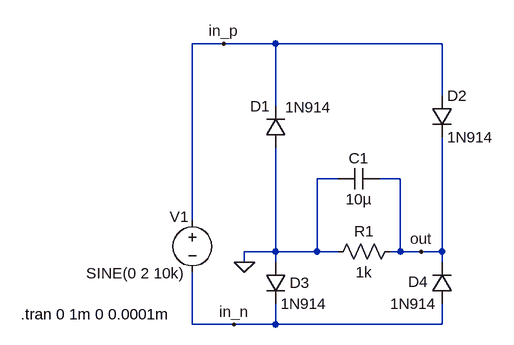
[diagram p0: schematic full_wave_rectifier_with_cap.asc]
full_wave_rectifier_with_cap.asc, the LTspice schematic file:
Version 4
SHEET 1 880 680
WIRE 96 -160 48 -160
WIRE 176 -160 96 -160
WIRE 432 -160 176 -160
WIRE 432 -80 432 -160
WIRE 176 -64 176 -160
WIRE 272 48 240 48
WIRE 368 48 336 48
WIRE 48 112 48 -160
WIRE 176 160 176 0
WIRE 176 160 128 160
WIRE 240 160 240 48
WIRE 240 160 176 160
WIRE 272 160 240 160
WIRE 368 160 368 48
WIRE 368 160 352 160
WIRE 400 160 368 160
WIRE 432 160 432 -16
WIRE 432 160 400 160
WIRE 128 176 128 160
WIRE 176 176 176 160
WIRE 432 176 432 160
WIRE 48 272 48 192
WIRE 112 272 48 272
WIRE 176 272 176 240
WIRE 176 272 112 272
WIRE 432 272 432 240
WIRE 432 272 176 272
FLAG 128 176 0
FLAG 400 160 out
FLAG 96 -160 in_p
FLAG 112 272 in_n
SYMBOL diode 192 0 R180
WINDOW 0 24 64 Left 2
WINDOW 3 -70 62 Left 2
SYMATTR InstName D1
SYMATTR Value 1N914
SYMBOL diode 416 -80 R0
SYMATTR InstName D2
SYMATTR Value 1N914
SYMBOL diode 160 176 R0
WINDOW 0 38 32 Left 2
SYMATTR InstName D3
SYMATTR Value 1N914
SYMBOL diode 448 240 R180
WINDOW 0 37 34 Left 2
WINDOW 3 24 0 Left 2
SYMATTR InstName D4
SYMATTR Value 1N914
SYMBOL voltage 48 96 R0
WINDOW 0 -35 10 Left 2
WINDOW 3 -163 97 Left 2
WINDOW 123 0 0 Left 0
WINDOW 39 0 0 Left 0
SYMATTR InstName V1
SYMATTR Value SINE(0 2 10k)
SYMBOL res 368 144 R90
WINDOW 0 0 56 VBottom 2
WINDOW 3 32 56 VTop 2
SYMATTR InstName R1
SYMATTR Value 1k
SYMBOL cap 336 32 R90
WINDOW 0 0 32 VBottom 2
WINDOW 3 32 32 VTop 2
SYMATTR InstName C1
SYMATTR Value 10µ
TEXT -216 256 Left 2 !.tran 0 1m 0 0.0001m

The netlist it stands for:
* full_wave_rectifier_with_cap.asc
D1 0 in_p 1N914
D2 in_p out 1N914
D3 0 in_n 1N914
D4 in_n out 1N914
V1 in_p in_n SINE(0 2 10k)
R1 out 0 1k
C1 out 0 10µ
.model D D
.lib standard.dio
.tran 0 1m 0 0.0001m
.backanno
.end